# Altium schematic sheet eps_sys.SchDoc
size A4
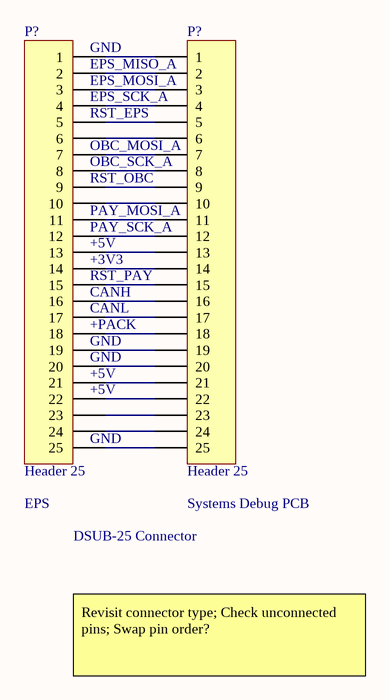
[diagram p0: eps_sys.SchDoc]

## Parts
(Parts that share a designator on the sheet are numbered #1, #2 ... from top to bottom, then left to right.)
P?#1  Header 25  [HDR1X25]
P?#2  Header 25  [HDR1X25]

## Nets
NetP?#1_1: P?#1.1 P?#2.1
NetP?#1_2: P?#1.2 P?#2.2
NetP?#1_3: P?#1.3 P?#2.3
NetP?#1_4: P?#1.4 P?#2.4
NetP?#1_5: P?#1.5 P?#2.5
NetP?#1_6: P?#1.6 P?#2.6
NetP?#1_7: P?#1.7 P?#2.7
NetP?#1_8: P?#1.8 P?#2.8
NetP?#1_9: P?#1.9 P?#2.9
NetP?#1_10: P?#1.10 P?#2.10
NetP?#1_11: P?#1.11 P?#2.11
NetP?#1_12: P?#1.12 P?#2.12
NetP?#1_13: P?#1.13 P?#2.13
NetP?#1_14: P?#1.14 P?#2.14
NetP?#1_15: P?#1.15 P?#2.15
NetP?#1_16: P?#1.16 P?#2.16
NetP?#1_17: P?#1.17 P?#2.17
NetP?#1_18: P?#1.18 P?#2.18
NetP?#1_19: P?#1.19 P?#2.19
NetP?#1_20: P?#1.20 P?#2.20
NetP?#1_21: P?#1.21 P?#2.21
NetP?#1_22: P?#1.22 P?#2.22
NetP?#1_23: P?#1.23 P?#2.23
NetP?#1_24: P?#1.24 P?#2.24
NetP?#1_25: P?#1.25 P?#2.25

## Notes on the sheet
- (near P?#1) GND
- (near P?#1) EPS_MISO_A
- (near P?#1) EPS_MOSI_A
- (near P?#1) EPS_SCK_A
- (near P?#1) RST_EPS
- (near P?#1) OBC_MOSI_A
- (near P?#1) OBC_SCK_A
- (near P?#1) RST_OBC
- (near P?#1) PAY_MOSI_A
- (near P?#1) PAY_SCK_A
- (near P?#1) +5V
- (near P?#1) +3V3
- (near P?#1) RST_PAY
- (near P?#1) CANH
- (near P?#1) CANL
- (near P?#1) +PACK
- (near P?#1) EPS
- (near P?#2) Systems Debug PCB
- DSUB-25 Connector
- Revisit connector type; Check unconnected pins; Swap pin order?

## Library data of the parts
P?#1 P?#2 = Header 25: Header, 25-Pin; LatestRevisionDate: 17-Jul-2002; LatestRevisionNote: Re-released for DXP Platform.; Publisher: Altium Limited